# EAGLE design ENZANKI (EAGLE 6.2)
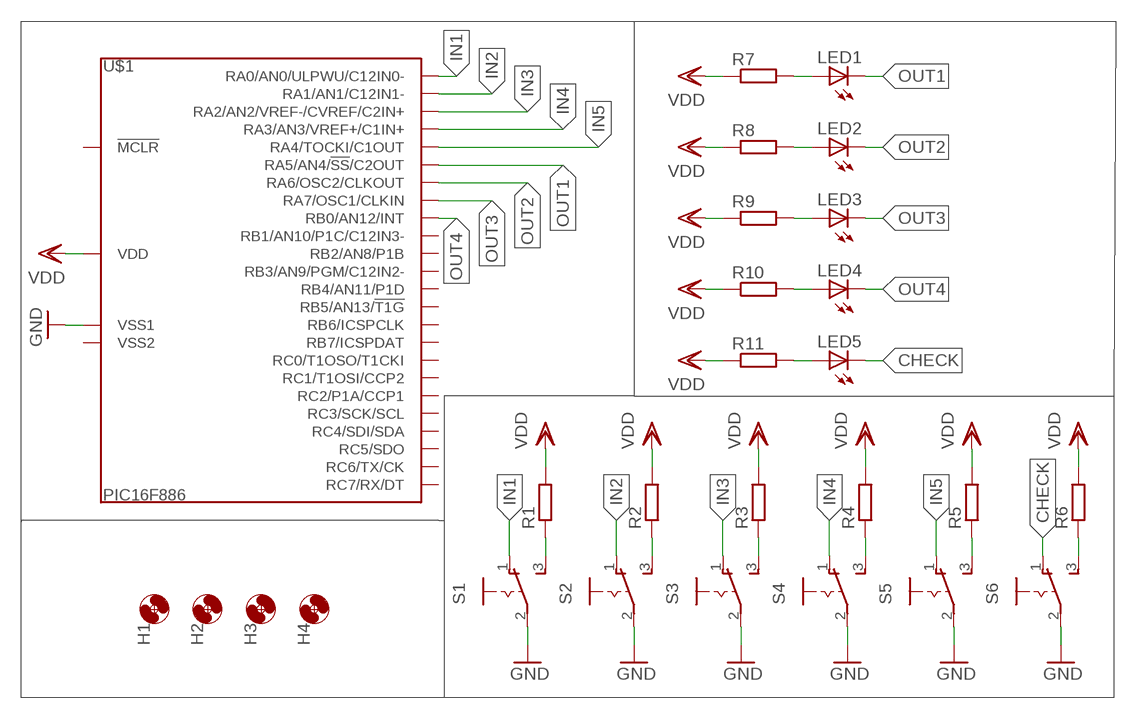
[diagram p0: schematic, sheet 1]

## Parts
H1  HOLE3.3M3BOLT  [HOLE3.3]
H2  HOLE3.3M3BOLT  [HOLE3.3]
H3  HOLE3.3M3BOLT  [HOLE3.3]
H4  HOLE3.3M3BOLT  [HOLE3.3]
LED1  LED5MM  [LED5MM]
LED2  LED5MM  [LED5MM]
LED3  LED5MM  [LED5MM]
LED4  LED5MM  [LED5MM]
LED5  LED5MM  [LED5MM]
R1  R-EU_R3216W  [R3216W]
R2  R-EU_R3216W  [R3216W]
R3  R-EU_R3216W  [R3216W]
R4  R-EU_R3216W  [R3216W]
R5  R-EU_R3216W  [R3216W]
R6  R-EU_R3216W  [R3216W]
R7  R-EU_R3216W  [R3216W]
R8  R-EU_R3216W  [R3216W]
R9  R-EU_R3216W  [R3216W]
R10  R-EU_R3216W  [R3216W]
R11  R-EU_R3216W  [R3216W]
S1  SLIDESW  [SLIDESW]
S2  SLIDESW  [SLIDESW]
S3  SLIDESW  [SLIDESW]
S4  SLIDESW  [SLIDESW]
S5  SLIDESW  [SLIDESW]
S6  SLIDESW  [SLIDESW]
U$1  PIC16F886  [DIL28]

## Nets
CHECK: LED5.K(C) S6.1
GND: S1.2 S2.2 S3.2 S4.2 S5.2 S6.2 U$1.8(VSS1)
IN1: S1.1 U$1.2(RA0/AN0/ULPWU/C12IN0-)
IN2: S2.1 U$1.3(RA1/AN1/C12IN1-)
IN3: S3.1 U$1.4(RA2/AN2/VREF-/CVREF/C2IN+)
IN4: S4.1 U$1.5(RA3/AN3/VREF+/C1IN+)
IN5: S5.1 U$1.6(RA4/TOCKI/C1OUT)
N$1: LED1.A R7.2
N$2: LED2.A R8.2
N$3: LED3.A R9.2
N$4: LED4.A R10.2
N$5: R6.1 S6.3
N$6: R2.1 S2.3
N$7: R3.1 S3.3
N$8: R4.1 S4.3
N$9: LED5.A R11.2
N$10: R5.1 S5.3
OUT1: LED1.K(C) U$1.7(RA5/AN4/!SS!/C2OUT)
OUT2: LED2.K(C) U$1.10(RA6/OSC2/CLKOUT)
OUT3: LED3.K(C) U$1.9(RA7/OSC1/CLKIN)
OUT4: LED4.K(C) U$1.21(RB0/AN12/INT)
R1: R1.1 S1.3
VDD: R1.2 R2.2 R3.2 R4.2 R5.2 R6.2 R7.1 R8.1 R9.1 R10.1 R11.1 U$1.20(VDD)
Unconnected: U$1.1(!MCLR) U$1.11(RC0/T1OSO/T1CKI) U$1.12(RC1/T1OSI/CCP2) U$1.13(RC2/P1A/CCP1) U$1.14(RC3/SCK/SCL) U$1.15(RC4/SDI/SDA) U$1.16(RC5/SDO) U$1.17(RC6/TX/CK) U$1.18(RC7/RX/DT) U$1.19(VSS2) U$1.22(RB1/AN10/P1C/C12IN3-) U$1.23(RB2/AN8/P1B) U$1.24(RB3/AN9/PGM/C12IN2-) U$1.25(RB4/AN11/P1D) U$1.26(RB5/AN13/!T1G) U$1.27(RB6/ICSPCLK) U$1.28(RB7/ICSPDAT)

## Library data of the parts
H1-H4 = Hole:HOLE3.3
LED1-LED5 = FP-21T for MITS:LED: LED OSRAM: - CHIPLED LG R971, LG N971, LY N971, LG Q971, LY Q971, LO R971, LY R971 LH N974, LH R974 LS Q976, LO Q976, LY Q976 LO Q996 - Hyper CHIPLED LW Q18S LB Q993, LB Q99A, LB R99A - SideLED LS A670, LO A670, LY A670, LG A670, LP A670 LB A673, LV A673, LT A673, LW A673 LH A674 LY A675 LS A676, LA A676, LO A676, LY A676, LW A676 LS A679, LY A679, LG A679 - Hyper Micro SIDELED® LS Y876, LA Y876, LO Y876, LY Y876 LT Y87S - SmartLED LW L88C, LW L88S LB L89C, LB L89S, LG L890 LS L89K, LO L89K, LY L89K LS L896, LA L896, LO L896, LY L896 - TOPLED LS T670, LO T670, LY T670, LG T670, LP T670 LSG T670, LSP T670, LSY T670, LOP T670, LYG T670 LG T671, LOG T671, LSG T671 LB T673, LV T673, LT T673, LW T673 LH T674 LS T676, LA T676, LO T676, LY T676, LB T676, LH T676, LSB T676, LW T676 LB T67C, LV T67C, LT T67C, LS T67K, LO T67K, LY T67K, LW E67C LS E67B, LA E67B, LO E67B, LY E67B, LB E67C, LV E67C, LT E67C LW T67C LS T679, LY T679, LG T679 LS T770, LO T770, LY T770, LG T770, LP T770 LB T773, LV T773, LT T773, LW T773 LH T774 LS E675, LA E675, LY E675, LS T675 LS T776, LA T776, LO T776, LY T776, LB T776 LHGB T686 LT T68C, LB T68C - Hyper Mini TOPLED® LB M676 - Mini TOPLED Santana® LG M470 LS M47K, LO M47K, LY M47K Source: http://www.osram.convergy.de - LUMILED® LXK2-PW12-R00, LXK2-PW12-S00, LXK2-PW14-U00, LXK2-PW14-V00 LXK2-PM12-R00, LXK2-PM12-S00, LXK2-PM14-U00 LXK2-PE12-Q00, LXK2-PE12-R00, LXK2-PE12-S00, LXK2-PE14-T00, LXK2-PE14-U00 LXK2-PB12-K00, LXK2-PB12-L00, LXK2-PB12-M00, LXK2-PB14-N00, LXK2-PB14-P00, LXK2-PB14-Q00 LXK2-PR12-L00, LXK2-PR12-M00, LXK2-PR14-Q00, LXK2-PR14-R00 LXK2-PD12-Q00, LXK2-PD12-R00, LXK2-PD12-S00 LXK2-PH12-R00, LXK2-PH12-S00 LXK2-PL12-P00, LXK2-PL12-Q00, LXK2-PL12-R00 Source: www.luxeon.com
R1-R11 = rcl:R-EU_: RESISTOR, European symbol
S1-S6 = switch:SLIDESW
U$1 = PIC:PIC16F886

## Board
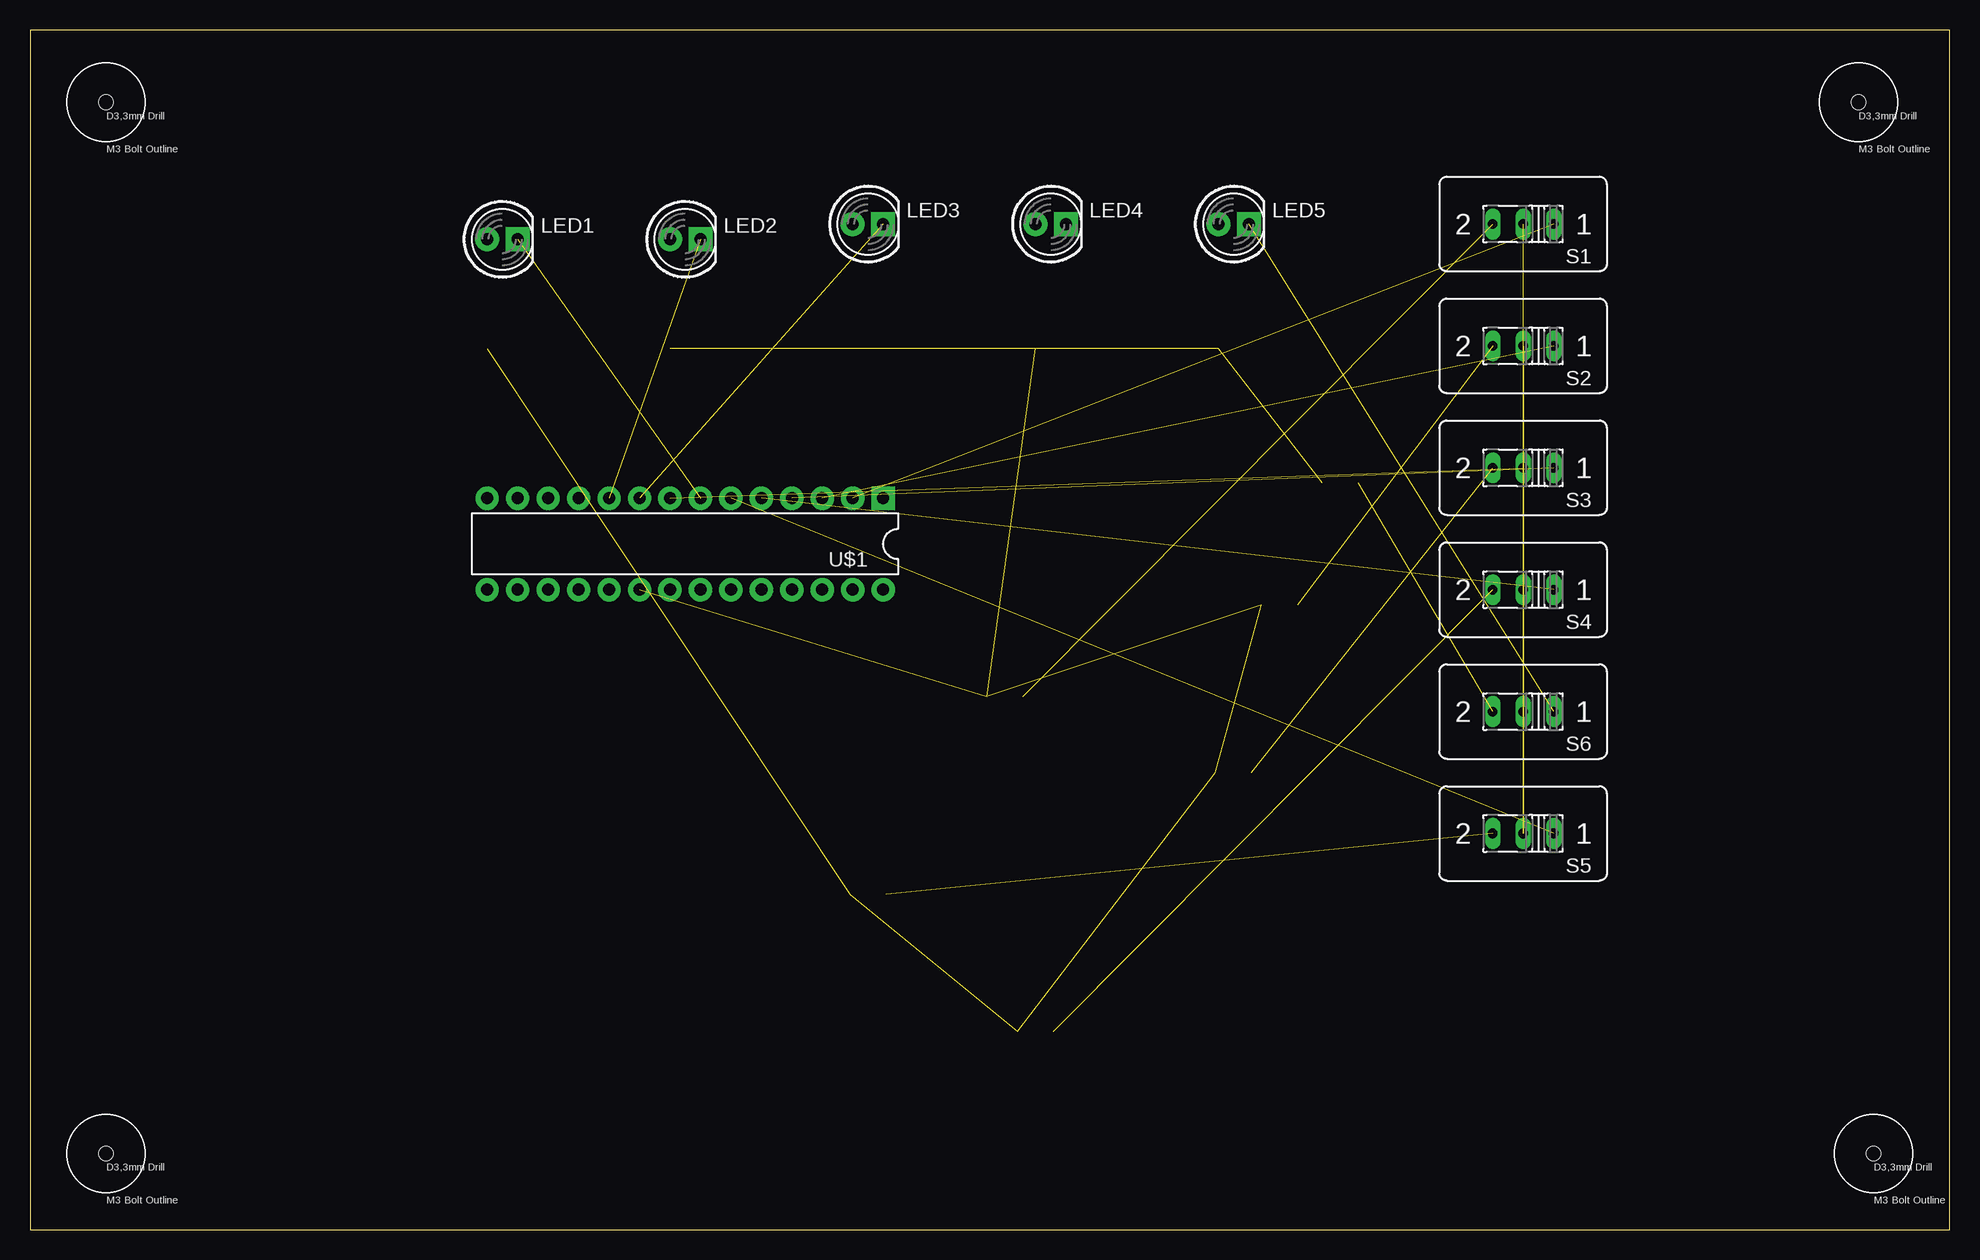
[diagram p1: board, top side]
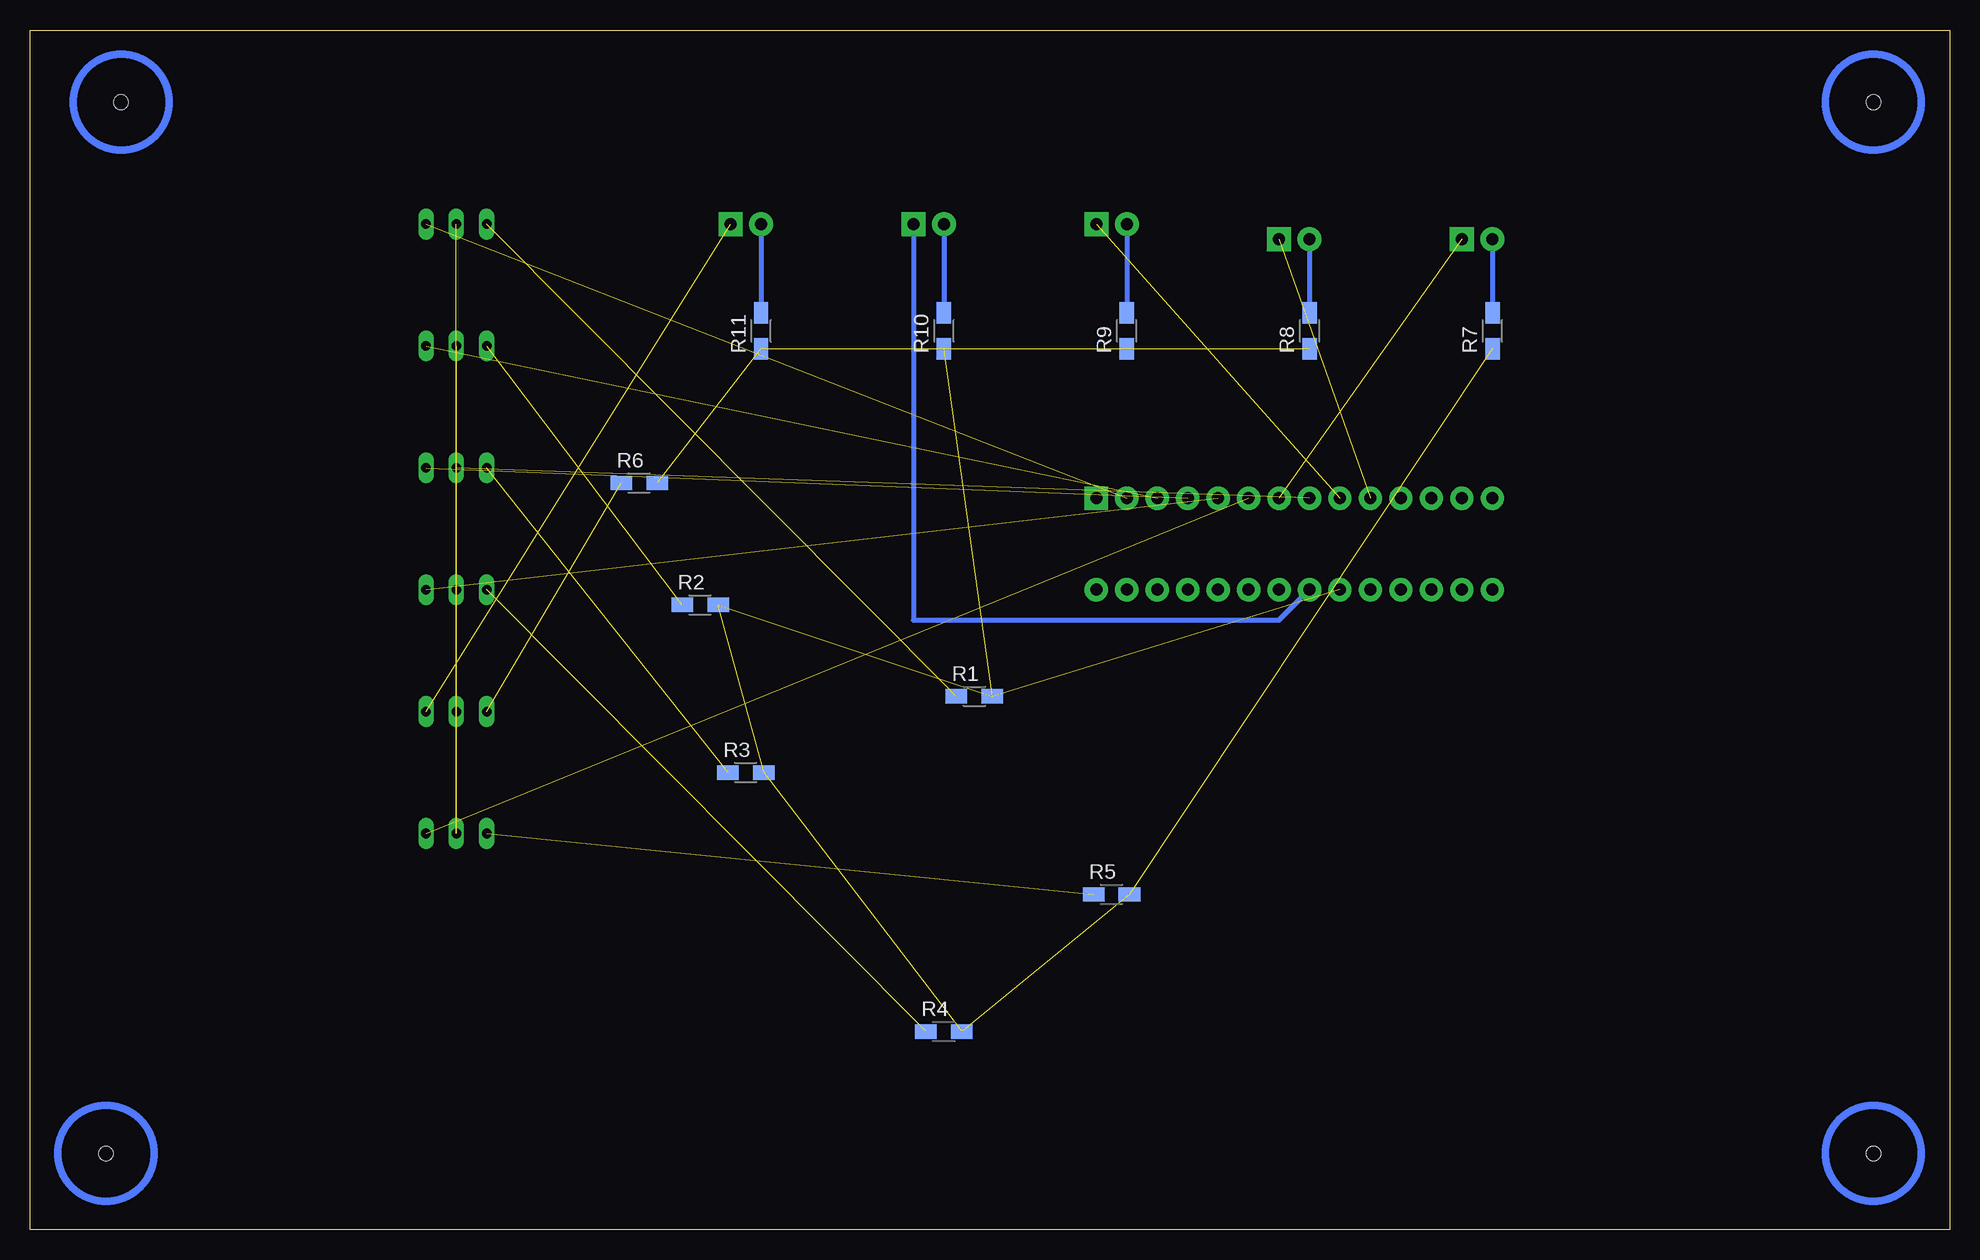
[diagram p2: board, bottom side, seen from below]

Size 160 x 100 mm. Coordinates in mm from the lower left corner, seen from the top.
Outline: 0,0 160,0 160,100 0,100 0,0
Copper layers (1*16): Top 0.035mm / dielectric 1.5mm / Bottom 0.035mm
Design rules: minimum track width 10mil, minimum drill 24mil, track to track 8mil, track to pad 8mil, pad to pad 8mil, via to via 8mil, smd to smd 8mil, copper to edge 40mil, drill to drill 8mil, minimum pad ring 10mil, minimum via ring 8mil, stop-mask expansion 4mil, vias tented up to drill 0mil, thermal gap 10mil

### Footprints (pad centres in the part's own frame; a part is rotated, then mirrored left to right if it is on the bottom)
HOLE3.3 = hole 1.2: 0,0
LED5MM = drill 1 pad 2: A -1.27,0 | drill 1 pad 2 square: K 1.27,0
R3216W = smd 1.8 x 1.2: 1 -1.499,0; 2 1.499,0
SLIDESW = drill 0.8 long: 1 -2.54,0; 2 0,0; 3 2.54,0
DIL28 = drill 1 pad 1.93 square: 1 -16.51,-3.81 | drill 1 pad 1.93: 2 -13.97,-3.81; 3 -11.43,-3.81; 4 -8.89,-3.81; 5 -6.35,-3.81; 6 -3.81,-3.81; 7 -1.27,-3.81; 8 1.27,-3.81; 9 3.81,-3.81; 10 6.35,-3.81; 11 8.89,-3.81; 12 11.43,-3.81; 13 13.97,-3.81; 14 16.51,-3.81; 15 16.51,3.81; 16 13.97,3.81; 17 11.43,3.81; 18 8.89,3.81; 19 6.35,3.81; 20 3.81,3.81; 21 1.27,3.81; 22 -1.27,3.81; 23 -3.81,3.81; 24 -6.35,3.81; 25 -8.89,3.81; 26 -11.43,3.81; 27 -13.97,3.81; 28 -16.51,3.81

### Placement (x,y rotation side)
H1  6.35,6.35 0 top
H2  152.4,93.98 0 top
H3  6.35,93.98 0 top
H4  153.67,6.35 0 top
LED1  39.37,82.55 0 top
LED2  54.61,82.55 0 top
LED3  69.85,83.82 0 top
LED4  85.09,83.82 0 top
LED5  100.33,83.82 0 top
R1  81.28,44.45 0 bottom
R2  104.14,52.07 0 bottom
R3  100.33,38.1 0 bottom
R4  83.82,16.51 0 bottom
R5  69.85,27.94 0 bottom
R6  109.22,62.23 0 bottom
R7  38.1,74.93 90 bottom
R8  53.34,74.93 90 bottom
R9  68.58,74.93 90 bottom
R10  83.82,74.93 90 bottom
R11  99.06,74.93 90 bottom
S1  124.46,83.82 180 top
S2  124.46,73.66 180 top
S3  124.46,63.5 180 top
S4  124.46,53.34 180 top
S5  124.46,33.02 180 top
S6  124.46,43.18 180 top
U$1  54.61,57.15 180 top

### Tracks (layer width: path | path; a pad name or v marks a point on that pad's centre or on a via)
CHECK  (1 unrouted)
GND  (6 unrouted)
IN1  (1 unrouted)
IN2  (1 unrouted)
IN3  (1 unrouted)
IN4  (1 unrouted)
IN5  (1 unrouted)
N$1
  Bottom 0.406: LED1.A R7.2
N$2
  Bottom 0.406: LED2.A R8.2
N$3
  Bottom 0.406: LED3.A R9.2
N$4
  Bottom 0.406: LED4.A R10.2
N$5  (1 unrouted)
N$6  (1 unrouted)
N$7  (1 unrouted)
N$8  (1 unrouted)
N$9
  Bottom 0.406: LED5.A R11.2
N$10  (1 unrouted)
OUT1  (1 unrouted)
OUT2  (1 unrouted)
OUT3  (1 unrouted)
OUT4
  Bottom 0.406: LED4.K 86.36,50.8 55.88,50.8 U$1.21
R1  (1 unrouted)
VDD  (11 unrouted)